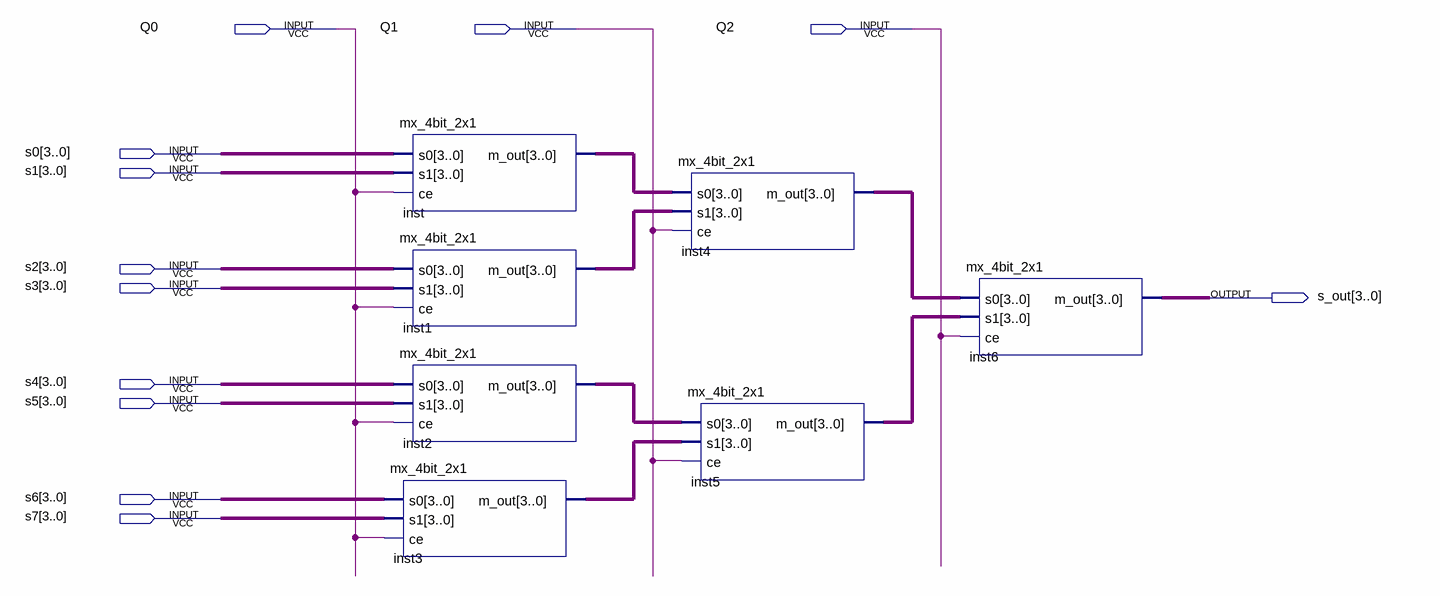
[diagram p0: schematic sheet]
// Quartus schematic mux_set.bdf as structural Verilog: 7 symbols, 12 pins
module mux_set (
  input  Q0,
  input  Q1,
  input  Q2,
  input  [3:0] s0,
  input  [3:0] s1,
  input  [3:0] s2,
  input  [3:0] s3,
  input  [3:0] s4,
  input  [3:0] s5,
  input  [3:0] s6,
  input  [3:0] s7,
  output [3:0] s_out
);

  wire [3:0] inst1_m_out, inst2_m_out, inst3_m_out, inst4_m_out, inst5_m_out, inst_m_out;

  mx_4bit_2x1 inst (.s0(s0), .s1(s1), .ce(Q0), .m_out(inst_m_out));
  mx_4bit_2x1 inst1 (.s0(s2), .s1(s3), .ce(Q0), .m_out(inst1_m_out));
  mx_4bit_2x1 inst2 (.s0(s4), .s1(s5), .ce(Q0), .m_out(inst2_m_out));
  mx_4bit_2x1 inst3 (.s0(s6), .s1(s7), .ce(Q0), .m_out(inst3_m_out));
  mx_4bit_2x1 inst4 (.s0(inst_m_out), .s1(inst1_m_out), .ce(Q1), .m_out(inst4_m_out));
  mx_4bit_2x1 inst5 (.s0(inst2_m_out), .s1(inst3_m_out), .ce(Q1), .m_out(inst5_m_out));
  mx_4bit_2x1 inst6 (.s0(inst4_m_out), .s1(inst5_m_out), .ce(Q2), .m_out(s_out));
endmodule
